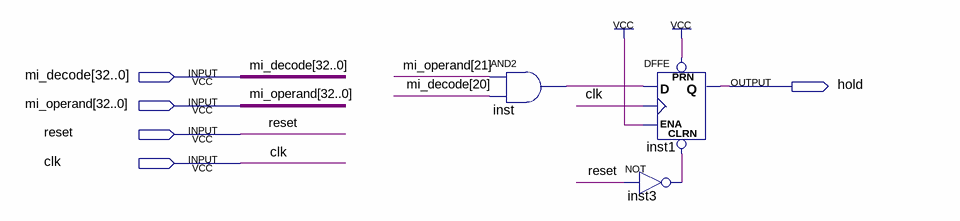
[diagram p0: schematic sheet]
// Quartus schematic uc_memory_dependency.bdf as structural Verilog: 3 symbols, 5 pins
module uc_memory_dependency (
  input  [32:0] mi_decode,
  input  [32:0] mi_operand,
  input  reset,
  input  clk,
  output hold
);

  wire inst3_out, inst_out;

  and inst (inst_out, mi_operand[21], mi_decode[20]);
  DFFE inst1 (.PRN(1'b1), .CLRN(inst3_out), .D(inst_out), .CLK(clk), .ENA(1'b1), .Q(hold));
  not inst3 (inst3_out, reset);
endmodule
